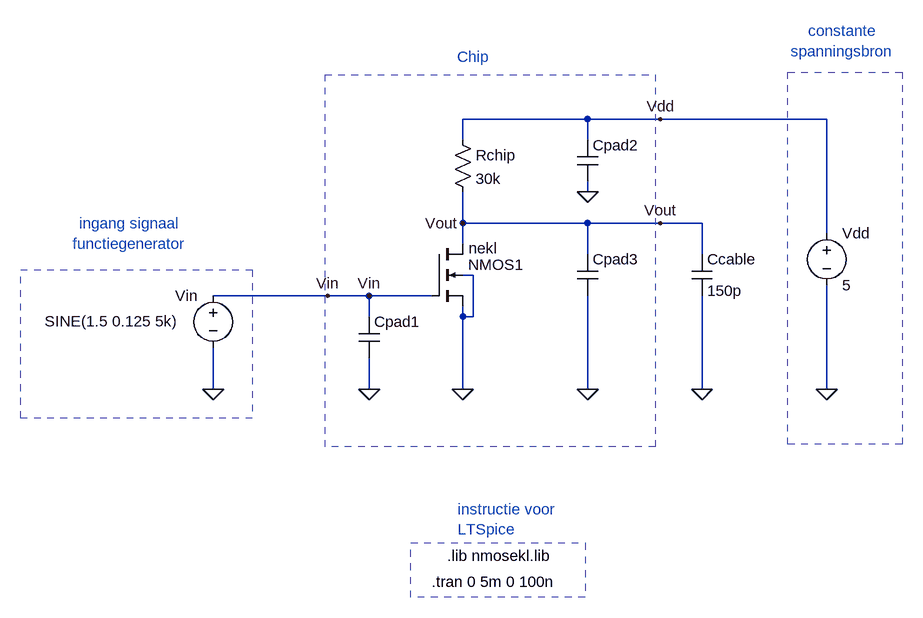
[diagram p0: schematic NMOS_EKL_analog_template_XYZ.asc]
NMOS_EKL_analog_template_XYZ.asc, the LTspice schematic file:
Version 4
SHEET 1 1212 692
WIRE 464 -48 272 -48
WIRE 576 -48 464 -48
WIRE 832 -48 576 -48
WIRE 272 -16 272 -48
WIRE 464 -16 464 -48
WIRE 464 64 464 48
WIRE 272 112 272 64
WIRE 464 112 272 112
WIRE 576 112 464 112
WIRE 640 112 576 112
WIRE 832 128 832 -48
WIRE 272 144 272 112
WIRE 464 160 464 112
WIRE 640 160 640 112
WIRE 288 192 272 192
WIRE 64 224 -112 224
WIRE 128 224 64 224
WIRE 224 224 128 224
WIRE 128 256 128 224
WIRE 272 256 272 240
WIRE 288 256 288 192
WIRE 288 256 272 256
WIRE -112 368 -112 304
WIRE 128 368 128 320
WIRE 272 368 272 256
WIRE 464 368 464 224
WIRE 640 368 640 224
WIRE 832 368 832 208
FLAG 272 368 0
FLAG 128 368 0
FLAG 832 368 0
FLAG 272 112 Vout
FLAG 464 64 0
FLAG -112 368 0
FLAG 464 368 0
FLAG 128 224 Vin
FLAG 640 368 0
FLAG 576 112 Vout
FLAG 576 -48 Vdd
FLAG 64 224 Vin
SYMBOL nmos4 224 144 R0
WINDOW 3 57 7 Left 2
SYMATTR Value nekl
SYMATTR InstName NMOS1
SYMATTR Value2 l=20u w=30u
SYMBOL voltage -112 208 M0
WINDOW 123 0 0 Left 2
WINDOW 39 0 0 Left 2
WINDOW 3 54 55 Left 2
SYMATTR Value SINE(1.5 0.125 5k)
SYMATTR InstName Vin
SYMBOL voltage 832 112 R0
WINDOW 123 0 0 Left 2
WINDOW 39 0 0 Left 2
SYMATTR InstName Vdd
SYMATTR Value 5
SYMBOL res 256 -32 R0
SYMATTR InstName Rchip
SYMATTR Value 30k
SYMBOL cap 448 -16 R0
SYMATTR InstName Cpad2
SYMATTR Value ""
SYMBOL cap 112 256 R0
SYMATTR InstName Cpad1
SYMATTR Value ""
SYMBOL cap 448 160 R0
SYMATTR InstName Cpad3
SYMATTR Value ""
SYMBOL cap 624 160 R0
SYMATTR InstName Ccable
SYMATTR Value 150p
TEXT 248 624 Left 2 !.lib nmosekl.lib
TEXT 224 664 Left 2 !.tran 0 5m 0 100n
TEXT 288 -144 Center 2 ;Chip
TEXT 856 -168 Center 2 ;constante\nspanningsbron
TEXT -240 128 Center 2 ;ingang signaal\nfunctiegenerator
TEXT 264 552 Left 2 ;instructie voor\nLTSpice
RECTANGLE Normal 60 -116 568 456 2
RECTANGLE Normal -408 184 -52 412 2
RECTANGLE Normal 772 -120 948 452 2
RECTANGLE Normal 192 604 460 688 2

The netlist it stands for:
* NMOS_EKL_analog_template_XYZ.asc
M§NMOS1 Vout Vin 0 0 nekl l=20u w=30u
Vin Vin 0 SINE(1.5 0.125 5k)
Vdd Vdd 0 5
Rchip Vdd Vout 30k
Cpad2 Vdd 0
Cpad1 Vin 0
Cpad3 Vout 0
Ccable Vout 0 150p
.model NMOS NMOS
.model PMOS PMOS
.lib standard.mos
.lib nmosekl.lib
.tran 0 5m 0 100n
* Chip
* constante
* spanningsbron
* ingang signaal
* functiegenerator
* instructie voor
* LTSpice
.backanno
.end